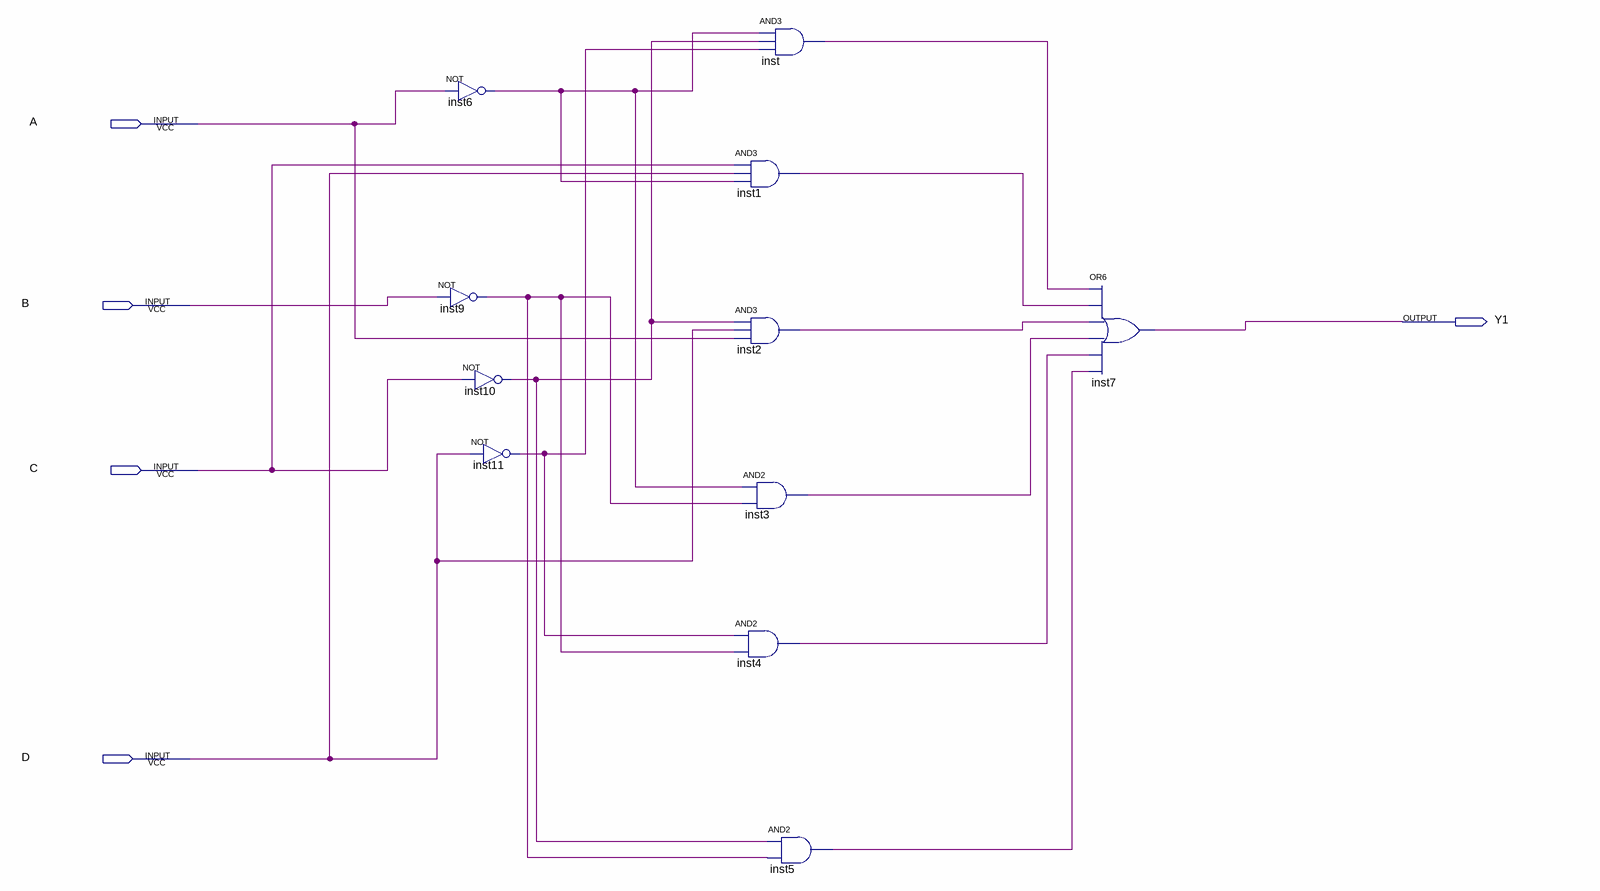
[diagram p0: schematic sheet]
// Quartus schematic one.bdf as structural Verilog: 11 symbols, 5 pins
module one (
  input  A,
  input  B,
  input  C,
  input  D,
  output Y1
);

  wire inst1_out, inst2_out, inst3_out, inst4_out, inst5_out, inst6_out, inst9_out, inst10_out, inst11_out,
       inst_out;

  not inst6 (inst6_out, A);
  not inst9 (inst9_out, B);
  not inst10 (inst10_out, C);
  not inst11 (inst11_out, D);
  and inst1 (inst1_out, C, D, inst6_out);
  and inst2 (inst2_out, inst10_out, D, A);
  and inst4 (inst4_out, inst11_out, inst9_out);
  and inst (inst_out, inst6_out, inst10_out, inst11_out);
  and inst3 (inst3_out, inst6_out, inst9_out);
  and inst5 (inst5_out, inst10_out, inst9_out);
  or inst7 (Y1, inst_out, inst1_out, inst2_out, inst3_out, inst4_out, inst5_out);
endmodule
